# Altium project UZ_D_Temperature_Card_LTC2983.PrjPCB
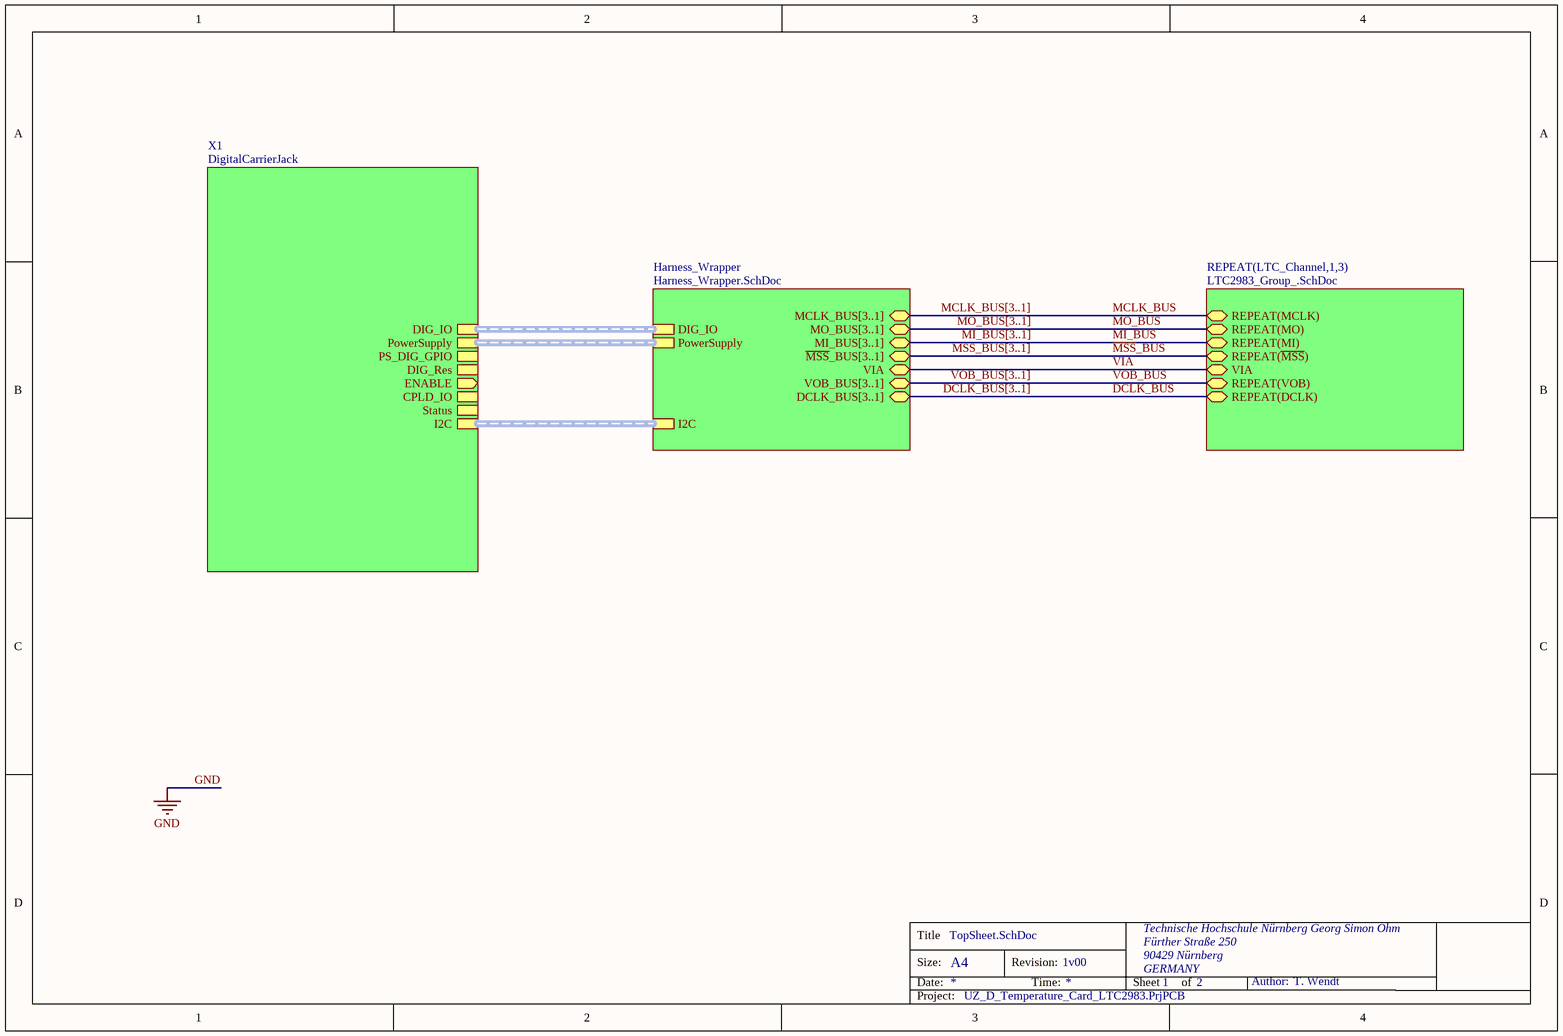
[diagram p0: TopSheet.SchDoc]
ProjectRevision: 1v00; ProjectNameCustom: UltraZohm_DigitalVoltage; FinDate: 2020/01; Date: 11/2019; AuthorParam: T. Wendt; Author: T. Wendt
2 sheets, 27 parts. Net scope: hierarchical (ports join the sheet entries above them; power ports are global).
Board file: UZ_D_Temperature_Card_LTC2983.PcbDoc
Sheets:
  TopSheet.SchDoc
    Harness_Wrapper = Harness_Wrapper.SchDoc

## Sheet TopSheet.SchDoc
size A4; Author: T. Wendt; CompanyName: Technische Hochschule Nürnberg Georg Simon Ohm; Address1: Fürther Straße 250; Address2: 90429 Nürnberg; Address3: GERMANY; DocumentNumber: 1; SheetNumber: 1; SheetTotal: 2; CompanyName2: Institut ELSYS

### Sub-sheets
Harness_Wrapper = Harness_Wrapper.SchDoc: DIG_IO (harness DigCon_DIG_IO), PowerSupply (harness DigCon_PowerSupply), I2C (harness DigCon_I2C), MCLK_BUS[3..1] (bidir), MO_BUS[3..1] (bidir), MI_BUS[3..1] (bidir), ~{MSS}_BUS[3..1] (bidir), VIA (bidir), VOB_BUS[3..1] (bidir), DCLK_BUS[3..1] (bidir)
REPEAT(LTC_Channel,1,3) = LTC2983_Group_.SchDoc (file not in this document): REPEAT(MCLK) (bidir), REPEAT(MO) (bidir), REPEAT(MI) (bidir), REPEAT(~{MSS}) (bidir), VIA (bidir), REPEAT(VOB) (bidir), REPEAT(DCLK) (bidir)
X1 = DigitalCarrierJack (file not in this document): DIG_IO (harness DigCon_DIG_IO), PowerSupply (harness DigCon_PowerSupply), PS_DIG_GPIO (harness DigCon_PS_DIG_GPIO), DIG_Res (harness DigCon_DIG_Res), ENABLE (out), CPLD_IO (harness DigCon_DCPLD_IO), Status (harness DigCon_Status), I2C (harness DigCon_I2C)

### Nets
DCLK_BUS: sheet REPEAT(LTC_Channel,1,3)/REPEAT(DCLK)
~{MSS}_BUS: sheet REPEAT(LTC_Channel,1,3)/REPEAT(~{MSS})
MCLK_BUS: sheet REPEAT(LTC_Channel,1,3)/REPEAT(MCLK)
MI_BUS: sheet REPEAT(LTC_Channel,1,3)/REPEAT(MI)
MO_BUS: sheet REPEAT(LTC_Channel,1,3)/REPEAT(MO)
VIA: sheet REPEAT(LTC_Channel,1,3)/VIA, sheet Harness_Wrapper/VIA
VOB_BUS: sheet REPEAT(LTC_Channel,1,3)/REPEAT(VOB)

### Buses and harness runs
bus DCLK_BUS[3..1] = sheet Harness_Wrapper/DCLK_BUS[3..1]
bus MCLK_BUS[3..1] = sheet Harness_Wrapper/MCLK_BUS[3..1]
bus MI_BUS[3..1] = sheet Harness_Wrapper/MI_BUS[3..1]
bus MO_BUS[3..1] = sheet Harness_Wrapper/MO_BUS[3..1]
bus VOB_BUS[3..1] = sheet Harness_Wrapper/VOB_BUS[3..1]
bus ~{MSS}_BUS[3..1] = sheet Harness_Wrapper/~{MSS}_BUS[3..1]
harness sheet Harness_Wrapper/DIG_IO = sheet X1/DIG_IO
harness sheet Harness_Wrapper/I2C = sheet X1/I2C
harness sheet Harness_Wrapper/PowerSupply = sheet X1/PowerSupply

### Notes on the sheet
- Title
- Size:
- Date:
- A4
- Revision:
- Time:
- Sheet
- of
- Author:
- Project:

## Sheet Harness_Wrapper.SchDoc
size A4
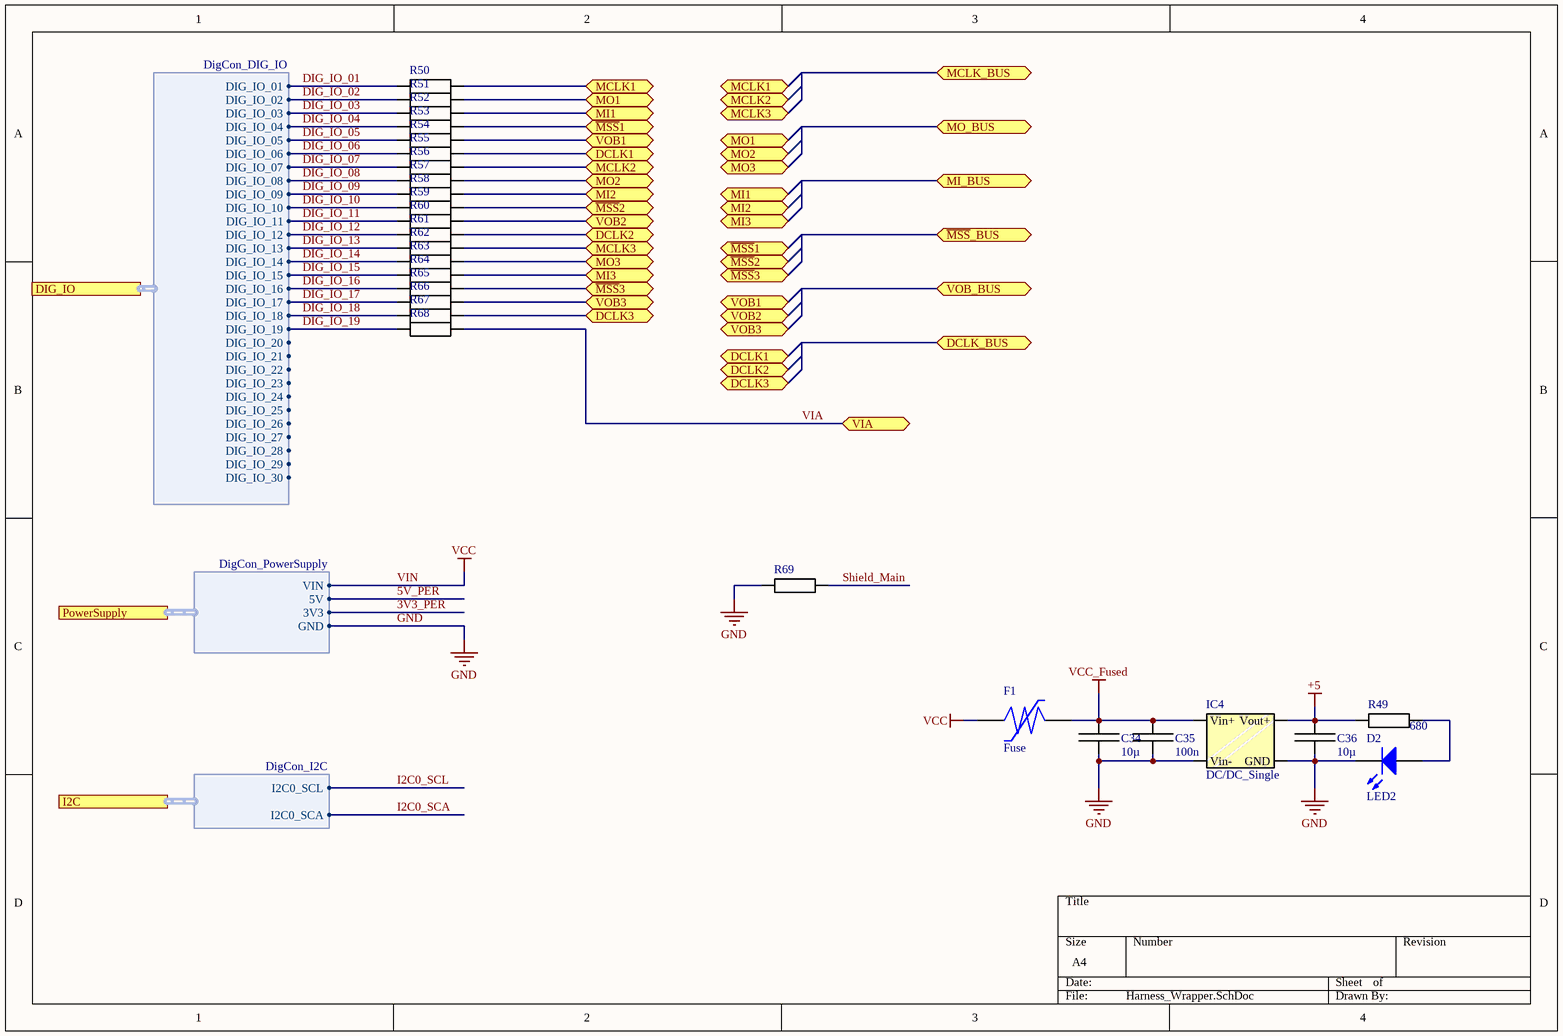
[diagram p1: Harness_Wrapper.SchDoc]

### Parts
C34  10µ  [RLC_0805]
C35  100n  [RLC_0805]
C36  10µ  [RLC_0805]
D2  LED2  [3.2X1.6X1.1]
F1  Fuse  [RLC_1812]
IC4  DC/DC_Single  [SIP4DCDC]
R49  680  [RLC_0805]
R50  100  [RLC_0805]  (value not drawn)
R51  100  [RLC_0805]  (value not drawn)
R52  100  [RLC_0805]  (value not drawn)
R53  100  [RLC_0805]  (value not drawn)
R54  100  [RLC_0805]  (value not drawn)
R55  100  [RLC_0805]  (value not drawn)
R56  100  [RLC_0805]  (value not drawn)
R57  100  [RLC_0805]  (value not drawn)
R58  100  [RLC_0805]  (value not drawn)
R59  100  [RLC_0805]  (value not drawn)
R60  100  [RLC_0805]  (value not drawn)
R61  100  [RLC_0805]  (value not drawn)
R62  100  [RLC_0805]  (value not drawn)
R63  100  [RLC_0805]  (value not drawn)
R64  100  [RLC_0805]  (value not drawn)
R65  100  [RLC_0805]  (value not drawn)
R66  100  [RLC_0805]  (value not drawn)
R67  100  [RLC_0805]  (value not drawn)
R68  100  [RLC_0805]  (value not drawn)
R69  0  [RLC_0805]  (value not drawn)

### Ports
DCLK1 (bidir), DCLK2 (bidir), DCLK3 (bidir), DCLK_BUS (bidir), DIG_IO (harness DigCon_DIG_IO), I2C (harness DigCon_I2C), MCLK1 (bidir), MCLK2 (bidir), MCLK3 (bidir), MCLK_BUS (bidir), MI1 (bidir), MI2 (bidir), MI3 (bidir), MI_BUS (bidir), MO1 (bidir), MO2 (bidir), MO3 (bidir), MO_BUS (bidir), PowerSupply (harness DigCon_PowerSupply), VIA (bidir), VOB1 (bidir), VOB2 (bidir), VOB3 (bidir), VOB_BUS (bidir), ~{MSS}1 (bidir), ~{MSS}2 (bidir), ~{MSS}3 (bidir), ~{MSS}_BUS (bidir)

### Harnesses
DigCon_DIG_IO: DIG_IO_01, DIG_IO_02, DIG_IO_03, DIG_IO_04, DIG_IO_05, DIG_IO_06, DIG_IO_07, DIG_IO_08, DIG_IO_09, DIG_IO_10, DIG_IO_11, DIG_IO_12, DIG_IO_13, DIG_IO_14, DIG_IO_15, DIG_IO_16, DIG_IO_17, DIG_IO_18, DIG_IO_19, DIG_IO_20, DIG_IO_21, DIG_IO_22, DIG_IO_23, DIG_IO_24, DIG_IO_25, DIG_IO_26, DIG_IO_27, DIG_IO_28, DIG_IO_29, DIG_IO_30
DigCon_PowerSupply: GND, 3V3, 5V, VIN
DigCon_I2C: I2C0_SCA, I2C0_SCL

### Nets
+5: C36.1 IC4.6(Vout+) R49.1
GND: C34.2 C35.2 C36.2 D2.2(K) IC4.2(Vin-) IC4.4(GND) R69.1 ; port PowerSupply.GND
VCC_Fused: C34.1 C35.1 F1.2 IC4.1(Vin+)
VIN: F1.1 ; port PowerSupply.VIN  [also labelled VCC]
3V3_PER: port PowerSupply.3V3
5V_PER: port PowerSupply.5V
DIG_IO_01: R50.1 ; port DIG_IO.DIG_IO_01
DIG_IO_02: R51.1 ; port DIG_IO.DIG_IO_02
DIG_IO_03: R52.1 ; port DIG_IO.DIG_IO_03
DIG_IO_04: R53.1 ; port DIG_IO.DIG_IO_04
DIG_IO_05: R54.1 ; port DIG_IO.DIG_IO_05
DIG_IO_06: R55.1 ; port DIG_IO.DIG_IO_06
DIG_IO_07: R56.1 ; port DIG_IO.DIG_IO_07
DIG_IO_08: R57.1 ; port DIG_IO.DIG_IO_08
DIG_IO_09: R58.1 ; port DIG_IO.DIG_IO_09
DIG_IO_10: R59.1 ; port DIG_IO.DIG_IO_10
DIG_IO_11: R60.1 ; port DIG_IO.DIG_IO_11
DIG_IO_12: R61.1 ; port DIG_IO.DIG_IO_12
DIG_IO_13: R62.1 ; port DIG_IO.DIG_IO_13
DIG_IO_14: R63.1 ; port DIG_IO.DIG_IO_14
DIG_IO_15: R64.1 ; port DIG_IO.DIG_IO_15
DIG_IO_16: R65.1 ; port DIG_IO.DIG_IO_16
DIG_IO_17: R66.1 ; port DIG_IO.DIG_IO_17
DIG_IO_18: R67.1 ; port DIG_IO.DIG_IO_18
DIG_IO_19: R68.1 ; port DIG_IO.DIG_IO_19
I2C0_SCA: port I2C.I2C0_SCA
I2C0_SCL: port I2C.I2C0_SCL
Shield_Main: R69.2
VIA: R68.2 ; port VIA
NetD2_1: D2.1(A) R49.2
NetR50_2: R50.2 ; port MCLK1
NetR51_2: R51.2 ; port MO1
NetR52_2: R52.2 ; port MI1
NetR53_2: R53.2 ; port ~{MSS}1
NetR54_2: R54.2 ; port VOB1
NetR55_2: R55.2 ; port DCLK1
NetR56_2: R56.2 ; port MCLK2
NetR57_2: R57.2 ; port MO2
NetR58_2: R58.2 ; port MI2
NetR59_2: R59.2 ; port ~{MSS}2
NetR60_2: R60.2 ; port VOB2
NetR61_2: R61.2 ; port DCLK2
NetR62_2: R62.2 ; port MCLK3
NetR63_2: R63.2 ; port MO3
NetR64_2: R64.2 ; port MI3
NetR65_2: R65.2 ; port ~{MSS}3
NetR66_2: R66.2 ; port VOB3
NetR67_2: R67.2 ; port DCLK3

### Library data of the parts
C34-C36 = C
D2 = LED2: Typical RED, GREEN, YELLOW, AMBER GaAs LED; Published: 8-Jun-2000; LatestRevisionDate: 17-Jul-2002; LatestRevisionNote: Re-released for DXP Platform.; PackageVersion: Feb-2002; PackageReference: 3.2X1.6X1.1; Publisher: Altium Limited; PackageDescription: SM LED; 2 Flat Leads
IC4 = DC/DC_Single: pin to pad: 1>2 2>1 4>3 6>4
R49-R69 = R